# Altium schematic sheet Sheet_1_2025-06-24.schdoc
size 224 x 96 mm
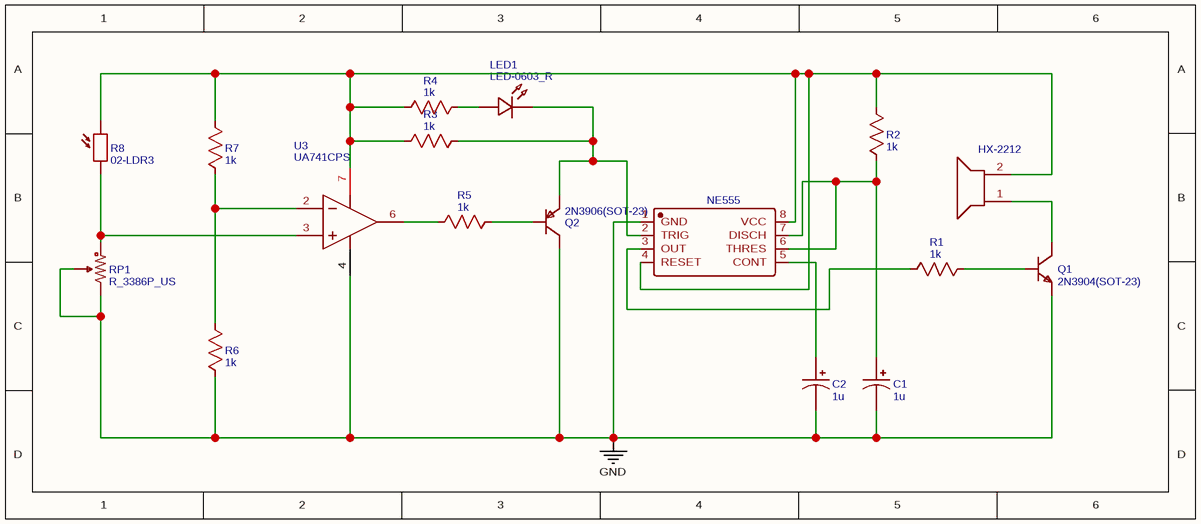
[diagram p0: Sheet_1_2025-06-24.schdoc]

## Parts
C1  1u  [CASE-A_3216]
C2  1u  [CASE-A_3216]
LED1  LED-0603_R  [LED0603_RED]
Q1  2N3904(SOT-23)  [SOT-23-3_L2.9-W1.3-P1.90-LS2.4-TR]
Q2  2N3906(SOT-23)  [SOT-23-3_L2.9-W1.6-P1.90-LS2.8-TR-CW]
R1  1k  [R0603]
R2  1k  [R0603]
R3  1k  [R0603]
R4  1k  [R0603]
R5  1k  [R0603]
R6  1k  [R0603]
R7  1k  [R0603]
R8  02-LDR3  [RES-TH_L5.0-W4.3-P3.40-D0.5]
RP1  R_3386P_US  [RES-ADJ-TH_3386P]
U1  HX-2212  [BUZ-TH_BD22.0-P10.00_BUZZER_PIEZO_HX-2212]
U2  NE555  [SOP-8_L5.0-W4.0-P1.27-LS6.0-BL]
U3  UA741CPS  [SOIC-8_L6.2-W5.3-P1.27-LS8.0-BL]

## Nets
GND: C1.2 C2.2 Q1.1(E) Q2.3(C) R6.1 RP1.2 RP1.3 U2.1(GND) U3.4(VSS)
NetC1_1: C1.1 R2.1 U2.6(THRES) U2.7(DISCH)
NetC2_1: C2.1 U2.5(CONT)
NetLED1_1: LED1.1 R4.2
NetLED1_2: LED1.2 Q2.1(E) R3.2 U2.2(TRIG)
NetQ1_2: Q1.2(B) R1.2
NetQ1_3: Q1.3(C) U1.1
NetQ2_2: Q2.2(B) R5.2
NetR1_1: R1.1 U2.3(OUT)
NetR2_2: R2.2 R3.1 R4.1 R7.2 R8.2 U1.2 U2.4(RESET) U2.8(VCC) U3.7(VDD)
NetR5_1: R5.1 U3.6(OUT)
NetR6_2: R6.2 R7.1 U3.2(-IN)
NetR8_1: R8.1 RP1.1 U3.3(+IN)

## Library data of the parts
C1 C2 = 1u: nameAlias: Value(F); Contributor: LCEDA_Lib; spicePre: C; spiceSymbolName: C_Tan_SMD_A_US
LED1 = LED-0603_R: Manufacturer: EVERLIGHT(台湾亿光); Manufacturer Part: 19-217/R6C-AL1M2VY/3T; Contributor: LCEDA_01; Supplier Part: C72044; Supplier: LCSC; spicePre: L; spiceSymbolName: LED-0603_R
Q1 = 2N3904(SOT-23): Manufacturer: KEC; Manufacturer Part: 2n3904S-RTK/PS; Contributor: LCEDA_Lib; Supplier: LCSC; Supplier Part: C18536; Paste Type: SOT-23; spicePre: Q; spiceSymbolName: 2N3904(SOT-23)
Q2 = 2N3906(SOT-23): Manufacturer: KEC; Manufacturer Part: 2N3906S-RTK/PS; Contributor: LCEDA_Lib; Supplier: LCSC; Supplier Part: C147294; spicePre: Q; spiceSymbolName: 2N3906(SOT-23)
R1-R7 = 1k: nameAlias: Value(Ω); Contributor: LCEDA_Lib; spicePre: R; spiceSymbolName: R_0603_US
R8 = 02-LDR3: Manufacturer: NTE Electronics; Contributor: lcsc; Supplier: LCSC; Supplier Part: C17361788; Manufacturer Part: 02-LDR3; JLCPCB Part Class: Extended Part; spicePre: R; spiceSymbolName: 02-LDR3
RP1 = R_3386P_US: nameAlias: Value; Contributor: LCEDA_Lib; value(Ω): 10K; Supplier: LCSC; spicePre: R; spiceSymbolName: R_3386P_US
U1 = HX-2212: Manufacturer: null; Contributor: lcsc; Supplier: LCSC; Supplier Part: C9900023877; Manufacturer Part: HX-2212; JLCPCB Part Class: Extended Part; spicePre: U; spiceSymbolName: HX-2212
U2 = NE555: Manufacturer: null; Contributor: LCSC; Supplier: LCSC; Supplier Part: C504549; Manufacturer Part: NE555; JLCPCB Part Class: Extended Part; spicePre: U; spiceSymbolName: NE555
U3 = UA741CPS: Manufacturer: TI(德州仪器); subpart_no: 1; Supplier: LCSC; Supplier Part: C5979364; Manufacturer Part: UA741CPS; JLCPCB Part Class: Extended Part; spicePre: U; spiceSymbolName: UA741CPS